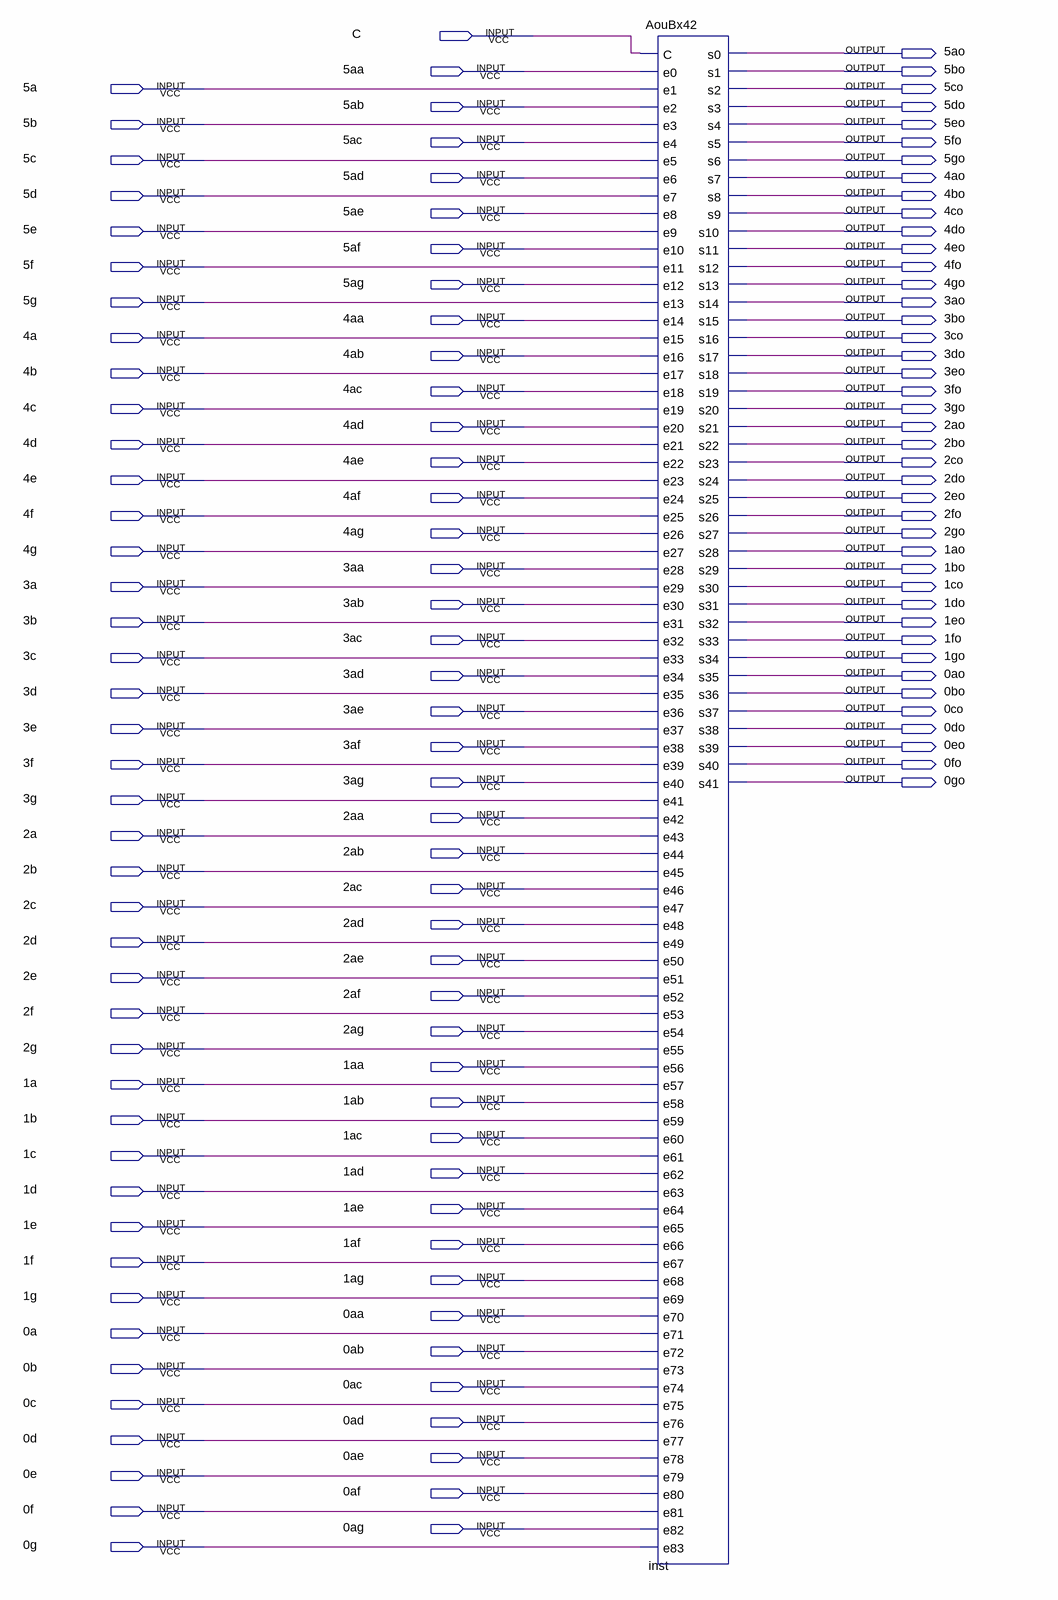
[diagram p0: schematic sheet]
// Quartus schematic Seletor7x6.bdf as structural Verilog: 1 symbols, 127 pins
module Seletor7x6 (
  input  C,
  input  \5aa ,
  input  \5a ,
  input  \5ab ,
  input  \5b ,
  input  \5ac ,
  input  \5c ,
  input  \5ad ,
  input  \5d ,
  input  \5ae ,
  input  \5e ,
  input  \5af ,
  input  \5f ,
  input  \5ag ,
  input  \5g ,
  input  \4aa ,
  input  \4a ,
  input  \4ab ,
  input  \4b ,
  input  \4ac ,
  input  \4c ,
  input  \4ad ,
  input  \4d ,
  input  \4ae ,
  input  \4e ,
  input  \4af ,
  input  \4f ,
  input  \4ag ,
  input  \4g ,
  input  \3aa ,
  input  \3a ,
  input  \3ab ,
  input  \3b ,
  input  \3ac ,
  input  \3c ,
  input  \3ad ,
  input  \3d ,
  input  \3ae ,
  input  \3e ,
  input  \3af ,
  input  \3f ,
  input  \3ag ,
  input  \3g ,
  input  \2aa ,
  input  \2a ,
  input  \2ab ,
  input  \2b ,
  input  \2ac ,
  input  \2c ,
  input  \2ad ,
  input  \2d ,
  input  \2ae ,
  input  \2e ,
  input  \2af ,
  input  \2f ,
  input  \2ag ,
  input  \2g ,
  input  \1aa ,
  input  \1a ,
  input  \1ab ,
  input  \1b ,
  input  \1ac ,
  input  \1c ,
  input  \1ad ,
  input  \1d ,
  input  \1ae ,
  input  \1e ,
  input  \1af ,
  input  \1f ,
  input  \1ag ,
  input  \1g ,
  input  \0aa ,
  input  \0a ,
  input  \0ab ,
  input  \0b ,
  input  \0ac ,
  input  \0c ,
  input  \0ad ,
  input  \0d ,
  input  \0ae ,
  input  \0e ,
  input  \0af ,
  input  \0f ,
  input  \0ag ,
  input  \0g ,
  output \5ao ,
  output \5bo ,
  output \5co ,
  output \5do ,
  output \5eo ,
  output \5fo ,
  output \5go ,
  output \4ao ,
  output \4bo ,
  output \4co ,
  output \4do ,
  output \4eo ,
  output \4fo ,
  output \4go ,
  output \3ao ,
  output \3bo ,
  output \3co ,
  output \3do ,
  output \3eo ,
  output \3fo ,
  output \3go ,
  output \2ao ,
  output \2bo ,
  output \2co ,
  output \2do ,
  output \2eo ,
  output \2fo ,
  output \2go ,
  output \1ao ,
  output \1bo ,
  output \1co ,
  output \1do ,
  output \1eo ,
  output \1fo ,
  output \1go ,
  output \0ao ,
  output \0bo ,
  output \0co ,
  output \0do ,
  output \0eo ,
  output \0fo ,
  output \0go 
);

  AouBx42 inst (
    .C(C), .e0(\5aa ), .e1(\5a ), .e2(\5ab ), .e3(\5b ), .e4(\5ac ), .e5(\5c ), .e6(\5ad ), .e7(\5d ),
    .e8(\5ae ), .e9(\5e ), .e10(\5af ), .e11(\5f ), .e12(\5ag ), .e13(\5g ), .e14(\4aa ), .e15(\4a ),
    .e16(\4ab ), .e17(\4b ), .e18(\4ac ), .e19(\4c ), .e20(\4ad ), .e21(\4d ), .e22(\4ae ), .e23(\4e ),
    .e24(\4af ), .e25(\4f ), .e26(\4ag ), .e27(\4g ), .e28(\3aa ), .e29(\3a ), .e30(\3ab ), .e31(\3b ),
    .e32(\3ac ), .e33(\3c ), .e34(\3ad ), .e35(\3d ), .e36(\3ae ), .e37(\3e ), .e38(\3af ), .e39(\3f ),
    .e40(\3ag ), .e41(\3g ), .e42(\2aa ), .e43(\2a ), .e44(\2ab ), .e45(\2b ), .e46(\2ac ), .e47(\2c ),
    .e48(\2ad ), .e49(\2d ), .e50(\2ae ), .e51(\2e ), .e52(\2af ), .e53(\2f ), .e54(\2ag ), .e55(\2g ),
    .e56(\1aa ), .e57(\1a ), .e58(\1ab ), .e59(\1b ), .e60(\1ac ), .e61(\1c ), .e62(\1ad ), .e63(\1d ),
    .e64(\1ae ), .e65(\1e ), .e66(\1af ), .e67(\1f ), .e68(\1ag ), .e69(\1g ), .e70(\0aa ), .e71(\0a ),
    .e72(\0ab ), .e73(\0b ), .e74(\0ac ), .e75(\0c ), .e76(\0ad ), .e77(\0d ), .e78(\0ae ), .e79(\0e ),
    .e80(\0af ), .e81(\0f ), .e82(\0ag ), .e83(\0g ), .s0(\5ao ), .s1(\5bo ), .s2(\5co ), .s3(\5do ),
    .s4(\5eo ), .s5(\5fo ), .s6(\5go ), .s7(\4ao ), .s8(\4bo ), .s9(\4co ), .s10(\4do ), .s11(\4eo ),
    .s12(\4fo ), .s13(\4go ), .s14(\3ao ), .s15(\3bo ), .s16(\3co ), .s17(\3do ), .s18(\3eo ), .s19(\3fo ),
    .s20(\3go ), .s21(\2ao ), .s22(\2bo ), .s23(\2co ), .s24(\2do ), .s25(\2eo ), .s26(\2fo ), .s27(\2go ),
    .s28(\1ao ), .s29(\1bo ), .s30(\1co ), .s31(\1do ), .s32(\1eo ), .s33(\1fo ), .s34(\1go ), .s35(\0ao ),
    .s36(\0bo ), .s37(\0co ), .s38(\0do ), .s39(\0eo ), .s40(\0fo ), .s41(\0go ));
endmodule
